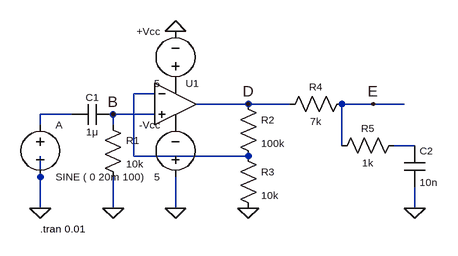
[diagram p0: schematic ερωτήματα 14-20.asc]
ερωτήματα 14-20.asc, the LTspice schematic file:
Version 4
SHEET 1 880 680
WIRE 112 144 80 144
WIRE 256 160 176 160
WIRE 320 160 256 160
WIRE 448 160 400 160
WIRE 496 160 448 160
WIRE -16 176 -64 176
WIRE 112 176 48 176
WIRE -64 192 -64 176
WIRE 48 192 48 176
WIRE 400 224 400 160
WIRE 512 224 480 224
WIRE 80 240 80 144
WIRE 256 240 80 240
WIRE -64 272 -64 240
WIRE -64 320 -64 272
WIRE 48 320 48 272
WIRE 144 320 144 272
WIRE 512 320 512 288
FLAG 144 48 0
FLAG 256 320 0
FLAG 48 320 0
FLAG -64 320 0
FLAG 144 320 0
FLAG 256 160 D
FLAG 512 320 0
FLAG 48 176 B
FLAG 448 160 E
SYMBOL cap 48 160 R90
WINDOW 0 0 32 VBottom 1
WINDOW 3 32 32 VTop 1
SYMATTR InstName C1
SYMATTR Value 1μ
SYMBOL res 32 176 R0
WINDOW 0 36 40 Left 1
WINDOW 3 36 76 Left 1
SYMATTR InstName R1
SYMATTR Value 10k
SYMBOL voltage -64 176 R0
WINDOW 0 24 16 Left 1
WINDOW 3 24 96 Left 1
SYMATTR InstName A
SYMATTR Value SINE ( 0 20m 100)
SYMBOL voltage 144 144 R180
WINDOW 0 24 96 Left 1
WINDOW 3 24 16 Left 1
SYMATTR InstName +Vcc
SYMATTR Value 5
SYMBOL voltage 144 288 R180
WINDOW 0 24 96 Left 1
WINDOW 3 24 16 Left 1
SYMATTR InstName -Vcc
SYMATTR Value 5
SYMBOL res 240 144 R0
WINDOW 0 36 40 Left 1
WINDOW 3 36 76 Left 1
SYMATTR InstName R2
SYMATTR Value 100k
SYMBOL res 240 224 R0
WINDOW 0 36 40 Left 1
WINDOW 3 36 76 Left 1
SYMATTR InstName R3
SYMATTR Value 10k
SYMBOL OpAmps\\UniversalOpamp2 144 160 R0
WINDOW 0 16 -32 Left 1
SYMATTR InstName U1
SYMBOL res 416 144 R90
WINDOW 0 0 56 VBottom 1
WINDOW 3 32 56 VTop 1
SYMATTR InstName R4
SYMATTR Value 7k
SYMBOL cap 496 224 R0
WINDOW 0 24 8 Left 1
WINDOW 3 24 56 Left 1
SYMATTR InstName C2
SYMATTR Value 10n
SYMBOL res 496 208 R90
WINDOW 0 0 56 VBottom 1
WINDOW 3 32 56 VTop 1
SYMATTR InstName R5
SYMATTR Value 1k
TEXT -64 352 Left 1 !.tran 0.01

The netlist it stands for:
* ερωτήματα 14-20.asc
C1 B N002 1μ
R1 B 0 10k
V§A N002 0 SINE ( 0 20m 100)
V§+Vcc P001 0 5
V§-Vcc 0 P002 5
R2 D N001 100k
R3 N001 0 10k
XU1 B N001 P001 P002 D level.2 Avol=1Meg GBW=10Meg Slew=10Meg ilimit=25m rail=0 Vos=0 phimargin=45 en=0 enk=0 in=0 ink=0 Rin=500Meg  ; pins IN+ IN- V+ V- OUT
R4 E D 7k
C2 N003 0 10n
R5 N003 E 1k
.tran 0.01
.lib UniversalOpamps2.sub
.backanno
.end